# Altium schematic sheet BMS029B_PinConfig.SchDoc: Pin Configuration
size 431 x 279 mm; Date: Not shown in title block; ApprovedBy: Not shown in title block; CheckedBy: Not shown in title block; Author: Not shown in title block; CompanyName: Not shown in title block; DrawnBy: M Sunna; Engineer: Not shown in title block; Organization: Not shown in title block; Address1: Not shown in title block; Address2: Not shown in title block; Address3: Not shown in title block; Address4: Not shown in title block; DocumentNumber: 2; Revision: Use project parameter SCH_Rev; SheetNumber: 2; SheetTotal: 5; PageSetup: Record=PageOptions|CenterHorizontal=True|CenterVertical=True|PrintScale=1.00|XCorrection=1.00|YCorrection=1.00|PrintKind=0|BorderSize=5000000|LeftOffset=0|BottomOffset=0|Orientation=2|PaperLength=1000|PaperWidth=1000|Scale=100|PaperSource=15|PrintQuality=600|MediaType=1|DitherType=10|PaperKind=Letter|PrintScaleMode=1; CurrentTime: Not shown in title block; CurrentDate: Not shown in title block; Time: Not shown in title block; DocumentFullPathAndName: Not shown in title block; DocumentName: Not shown in title block; ModifiedDate: Not shown in title block; ImagePath: Not shown in title block
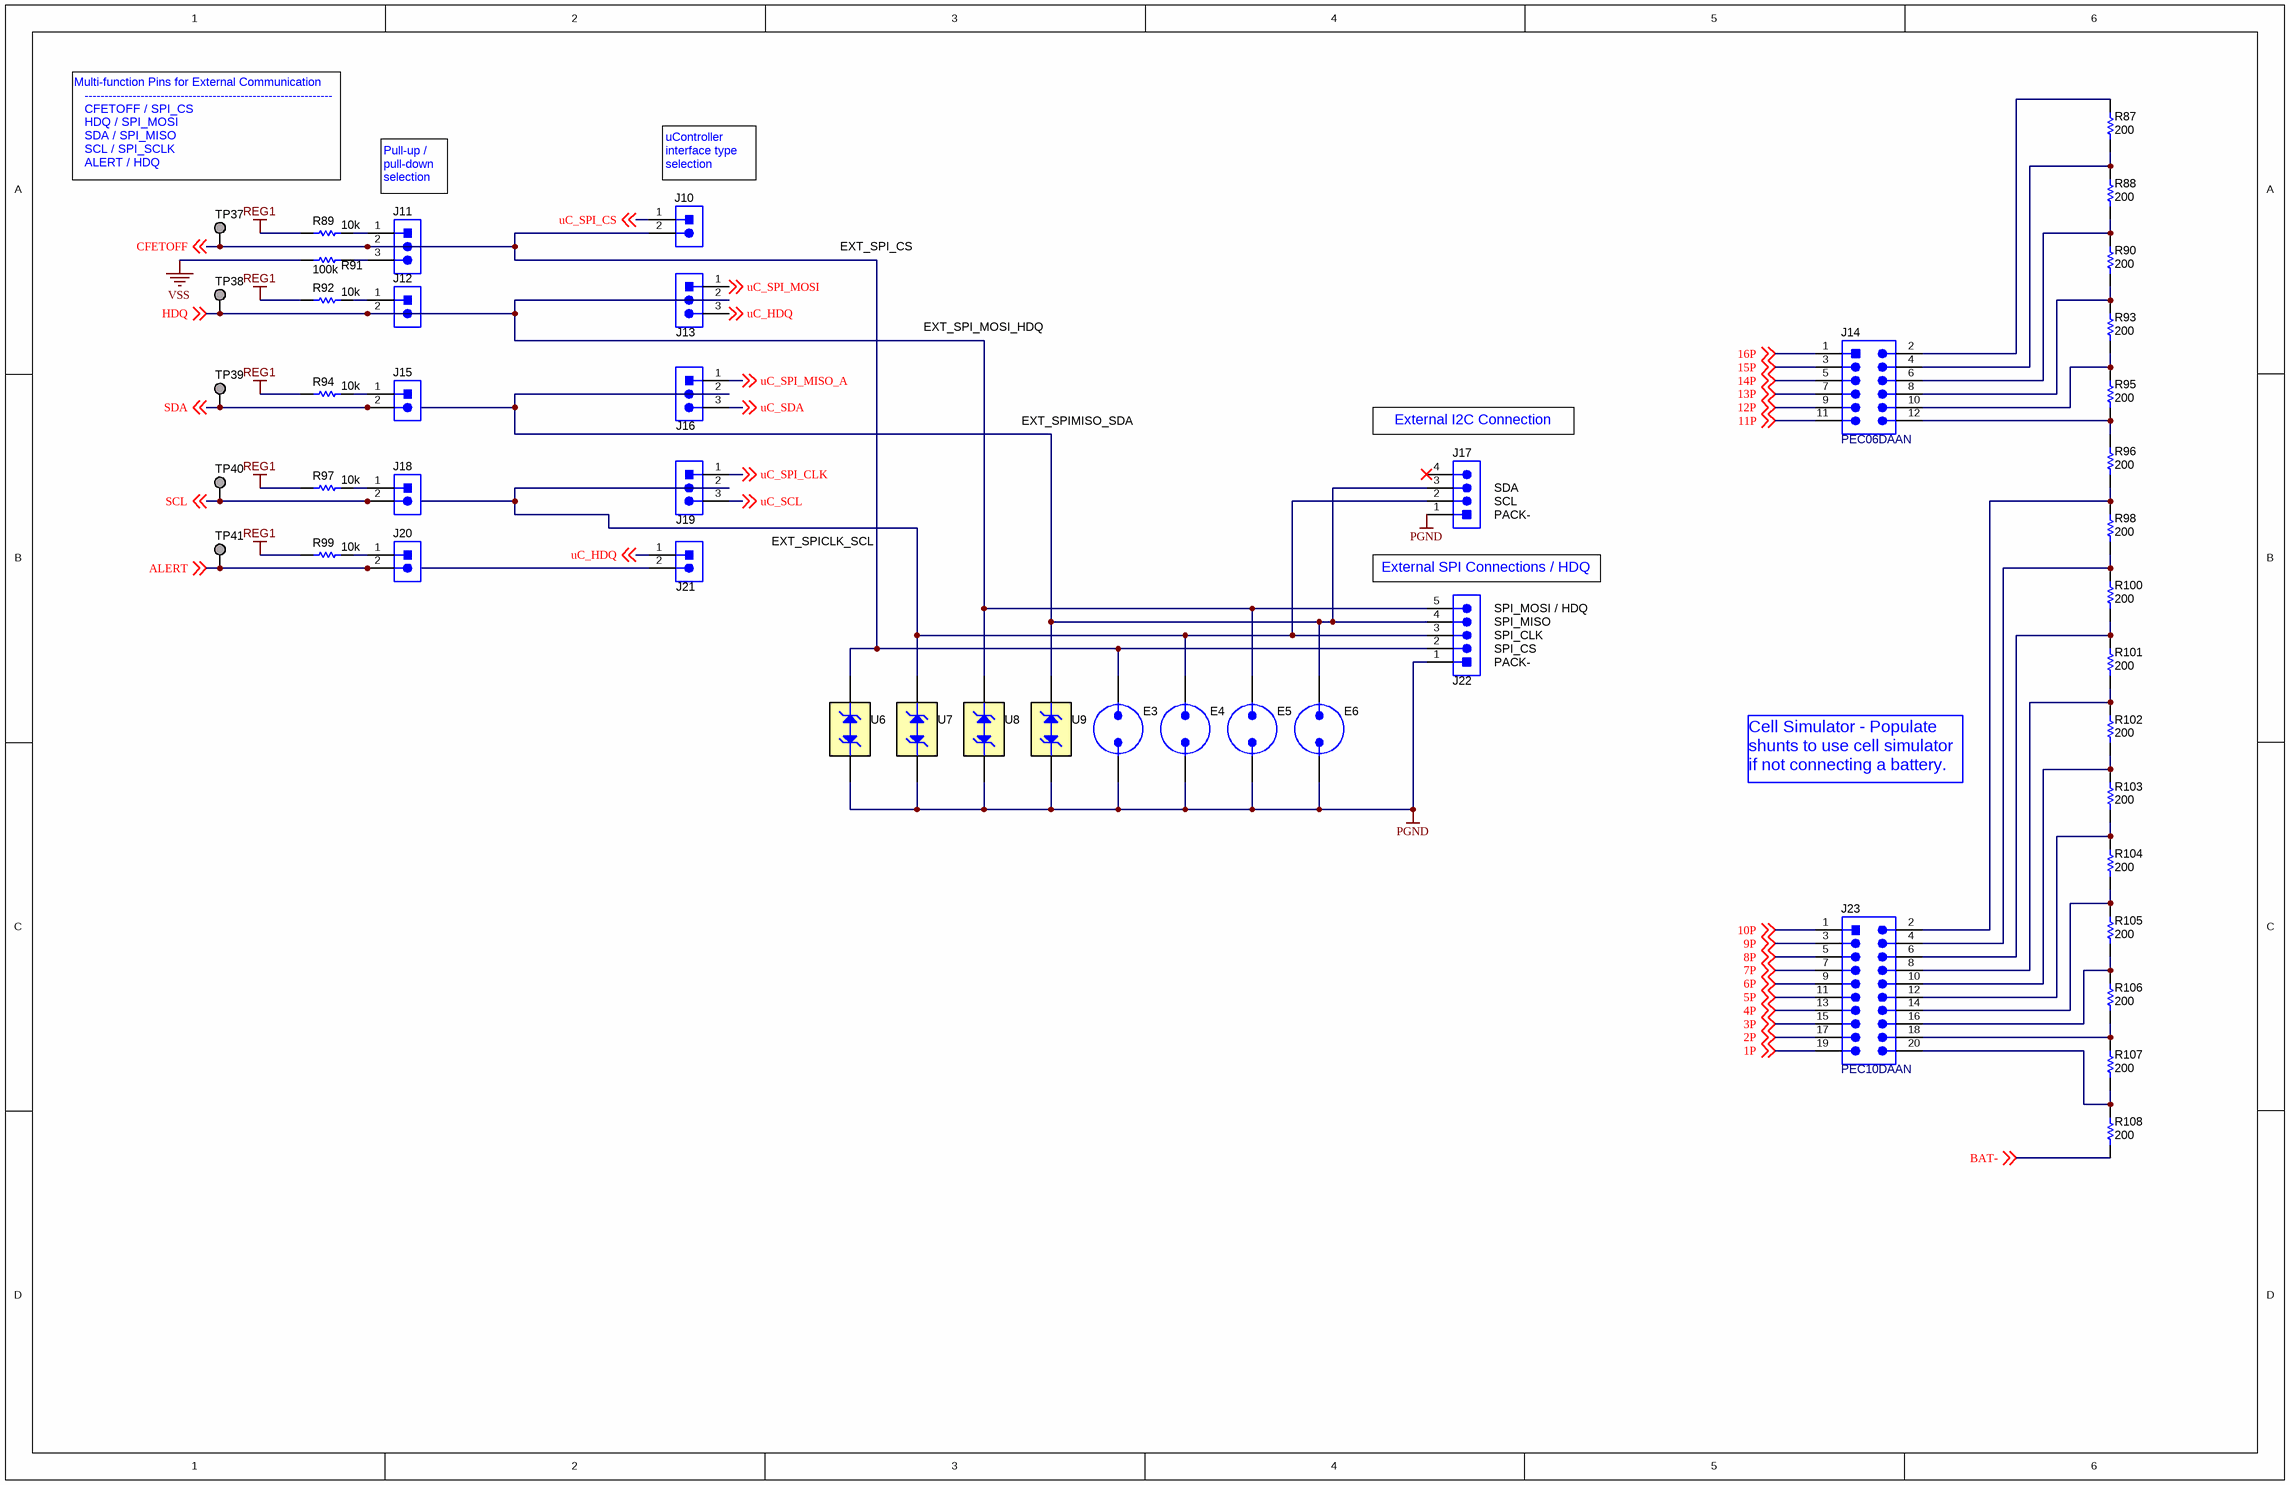
[diagram p0: BMS029B_PinConfig.SchDoc]

## Parts
E3  Spark Gap  [SPARK_GAP2]  (value not drawn)  (no BOM)
E4  Spark Gap  [SPARK_GAP2]  (value not drawn)  (no BOM)
E5  Spark Gap  [SPARK_GAP2]  (value not drawn)  (no BOM)
E6  Spark Gap  [SPARK_GAP2]  (value not drawn)  (no BOM)
J10  PEC02SAAN  [CONN_PEC02SAAN]  (value not drawn)
J11  87898-0304  [Molex_87898-0304]  (value not drawn)
J12  PEC02SAAN  [CONN_PEC02SAAN]  (value not drawn)
J13  87898-0304  [Molex_87898-0304]  (value not drawn)
J14  PEC06DAAN  [CONN_PEC06DAAN]
J15  PEC02SAAN  [CONN_PEC02SAAN]  (value not drawn)
J16  87898-0304  [Molex_87898-0304]  (value not drawn)
J17  22/05/3041  [CONN_22-05-3041]  (value not drawn)
J18  PEC02SAAN  [CONN_PEC02SAAN]  (value not drawn)
J19  87898-0304  [Molex_87898-0304]  (value not drawn)
J20  PEC02SAAN  [CONN_PEC02SAAN]  (value not drawn)
J21  PEC02SAAN  [CONN_PEC02SAAN]  (value not drawn)
J22  PEC05SAAN  [Sullins_PxC05SAAN]  (value not drawn)
J23  PEC10DAAN  [SULLINS_PEC10DAAN]
R87  ValueDisplayed: 200  [1206]  (hidden comment: CRCW1206200RFKEA)
R88  ValueDisplayed: 200  [1206]  (hidden comment: CRCW1206200RFKEA)
R89  ValueDisplayed: 10k  [0603]  (hidden comment: CRCW060310K0JNEA)
R90  ValueDisplayed: 200  [1206]  (hidden comment: CRCW1206200RFKEA)
R91  ValueDisplayed: 100k  [0603]  (hidden comment: CRCW0603100KJNEA)
R92  ValueDisplayed: 10k  [0603]  (hidden comment: CRCW060310K0JNEA)
R93  ValueDisplayed: 200  [1206]  (hidden comment: CRCW1206200RFKEA)
R94  ValueDisplayed: 10k  [0603]  (hidden comment: CRCW060310K0JNEA)
R95  ValueDisplayed: 200  [1206]  (hidden comment: CRCW1206200RFKEA)
R96  ValueDisplayed: 200  [1206]  (hidden comment: CRCW1206200RFKEA)
R97  ValueDisplayed: 10k  [0603]  (hidden comment: CRCW060310K0JNEA)
R98  ValueDisplayed: 200  [1206]  (hidden comment: CRCW1206200RFKEA)
R99  ValueDisplayed: 10k  [0603]  (hidden comment: CRCW060310K0JNEA)
R100  ValueDisplayed: 200  [1206]  (hidden comment: CRCW1206200RFKEA)
R101  ValueDisplayed: 200  [1206]  (hidden comment: CRCW1206200RFKEA)
R102  ValueDisplayed: 200  [1206]  (hidden comment: CRCW1206200RFKEA)
R103  ValueDisplayed: 200  [1206]  (hidden comment: CRCW1206200RFKEA)
R104  ValueDisplayed: 200  [1206]  (hidden comment: CRCW1206200RFKEA)
R105  ValueDisplayed: 200  [1206]  (hidden comment: CRCW1206200RFKEA)
R106  ValueDisplayed: 200  [1206]  (hidden comment: CRCW1206200RFKEA)
R107  ValueDisplayed: 200  [1206]  (hidden comment: CRCW1206200RFKEA)
R108  ValueDisplayed: 200  [1206]  (hidden comment: CRCW1206200RFKEA)
TP37  TESTPOINT  [TP_50MIL-25MILHOLE]  (value not drawn)  (no BOM)
TP38  TESTPOINT  [TP_50MIL-25MILHOLE]  (value not drawn)  (no BOM)
TP39  TESTPOINT  [TP_50MIL-25MILHOLE]  (value not drawn)  (no BOM)
TP40  TESTPOINT  [TP_50MIL-25MILHOLE]  (value not drawn)  (no BOM)
TP41  TESTPOINT  [TP_50MIL-25MILHOLE]  (value not drawn)  (no BOM)
U6  TPD1E10B06DPYR  [DPY0002A]  (value not drawn)
U7  TPD1E10B06DPYR  [DPY0002A]  (value not drawn)
U8  TPD1E10B06DPYR  [DPY0002A]  (value not drawn)
U9  TPD1E10B06DPYR  [DPY0002A]  (value not drawn)

## Nets
PGND: E3.2 E4.2 E5.2 E6.2 J17.1 J22.1 U6.2(A) U7.2(A) U8.2(A) U9.2(A)
REG1: R89.1 R92.1 R94.1 R97.1 R99.1
VSS: R91.1
1P: J23.19 ; off-sheet 1P
2P: J23.17 ; off-sheet 2P
3P: J23.15 ; off-sheet 3P
4P: J23.13 ; off-sheet 4P
5P: J23.11 ; off-sheet 5P
6P: J23.9 ; off-sheet 6P
7P: J23.7 ; off-sheet 7P
8P: J23.5 ; off-sheet 8P
9P: J23.3 ; off-sheet 9P
10P: J23.1 ; off-sheet 10P
11P: J14.11 ; off-sheet 11P
12P: J14.9 ; off-sheet 12P
13P: J14.7 ; off-sheet 13P
14P: J14.5 ; off-sheet 14P
15P: J14.3 ; off-sheet 15P
16P: J14.1 ; off-sheet 16P
ALERT: J20.2 J21.2 TP41.1 ; off-sheet ALERT
BAT-: R108.1 ; off-sheet BAT-
CFETOFF: E3.1 J10.2 J11.2 J22.2 TP37.1 U6.1(K) ; off-sheet CFETOFF
HDQ: E5.1 J12.2 J13.2 J22.5 TP38.1 U8.1(K) ; off-sheet HDQ
SCL: E4.1 J17.2 J18.2 J19.2 J22.3 TP40.1 U7.1(K) ; off-sheet SCL
SDA: E6.1 J15.2 J16.2 J17.3 J22.4 TP39.1 U9.1(K) ; off-sheet SDA
uC_HDQ: J13.3 J21.1 ; off-sheet uC_HDQ
uC_SCL: J19.3 ; off-sheet uC_SCL
uC_SDA: J16.3 ; off-sheet uC_SDA
uC_SPI_CLK: J19.1 ; off-sheet uC_SPI_CLK
uC_SPI_CS: J10.1 ; off-sheet uC_SPI_CS
uC_SPI_MISO_A: J16.1 ; off-sheet uC_SPI_MISO_A
uC_SPI_MOSI: J13.1 ; off-sheet uC_SPI_MOSI
NetJ11_1: J11.1 R89.2
NetJ11_3: J11.3 R91.2
NetJ12_1: J12.1 R92.2
NetJ14_2: J14.2 R87.2
NetJ14_4: J14.4 R87.1 R88.2
NetJ14_6: J14.6 R88.1 R90.2
NetJ14_8: J14.8 R90.1 R93.2
NetJ14_10: J14.10 R93.1 R95.2
NetJ14_12: J14.12 R95.1 R96.2
NetJ15_1: J15.1 R94.2
NetJ18_1: J18.1 R97.2
NetJ20_1: J20.1 R99.2
NetJ23_2: J23.2 R96.1 R98.2
NetJ23_4: J23.4 R98.1 R100.2
NetJ23_6: J23.6 R100.1 R101.2
NetJ23_8: J23.8 R101.1 R102.2
NetJ23_10: J23.10 R102.1 R103.2
NetJ23_12: J23.12 R103.1 R104.2
NetJ23_14: J23.14 R104.1 R105.2
NetJ23_16: J23.16 R105.1 R106.2
NetJ23_18: J23.18 R106.1 R107.2
NetJ23_20: J23.20 R107.1 R108.2

Not connected (* = marked no-connect by the designer): J17 4*

## Notes on the sheet
- Multi-function Pins for External Communication
  --------------------------------------------------------------
  CFETOFF / SPI_CS
  HDQ / SPI_MOSI
  SDA / SPI_MISO
  SCL / SPI_SCLK
  ALERT / HDQ
- Pull-up / pull-down selection
- (near J10) uController interface type selection
- EXT_SPI_CS
- EXT_SPI_MOSI_HDQ
- EXT_SPIMISO_SDA
- (near J17) External I2C Connection
- (near J17) SDA
- (near J17) SCL
- EXT_SPICLK_SCL
- (near J17) PACK-
- External SPI Connections / HDQ
- (near J22) SPI_MISO
- (near J22) SPI_MOSI / HDQ
- (near J22) SPI_CLK
- (near J22) SPI_CS
- (near J22) PACK-
- Cell Simulator - Populate shunts to use cell simulator if not connecting a battery.

## Library data of the parts
E3-E6 = CMP-0079939-1: CompType: Spark Gap
J10 J12 J15 J18 J20 J21 = CMP-0002337-1: Header, 100mil, 2x1, Tin, TH; Manufacturer: Sullins Connector Solutions; CNHeader: TRUE; Current_A: 3A; Green_Lifecycle: Not Set; Shrouded: N; Gender: Male; Green_REACh: Incomplete; Voltage_V: 1.8kV; Row_Count: 1; Pitch_mm: 2.54; CT: FALSE; Cert_UL: Y; ComponentLink1URL: http://www.sullinscorp.com/catalogs/77_PAGE108-109_.100_MALE_HDR.pdf; ClassName: Header; Publisher: Texas Instruments; Color: Black; RoHS: Y; MountType: TH; Green_EU RoHS-2: Incomplete; Supplier 1: Digi-Key; Green_EU RoHS: Incomplete; PackageReference: Header, 2 PIN, 100mil, Tin; PinCount: 2; CompType: Header; LatestRevisionDate: 26/05/2017; PartNumber: PEC02SAAN; Orientation: Vertical; ComponentLink1Description: Datasheet URL; Supplier Part Number 1: S1012E-02-ND; ContactFinish: Tin
J11 J13 J16 J19 = CMP-0075388-1: Header, 2.54mm, 3x1, Gold, SMT; Manufacturer: Molex; Pitch_mm: 2.54; Gender: Male; Cert_CSA: Y; Current_A: 3A; Voltage_V: 250V; CT: False; Shrouded: N; Row_Count: 1; CNHeader: True; ComponentLink1Description: Datasheet URL; RoHS: Y; Supplier Part Number 3: 538-87898-0304; Supplier 1: Digi-Key; Cert_UL: Y; Orientation: Vertical; PackageReference: Header, 2.54mm, 3x1, SMT; Color: Black; PartNumber: 87898-0304; PinCount: 3; Publisher: Texas Instruments; Supplier Part Number 2: 39T3063; ContactFinish: Gold; Supplier 2: Newark; ClassName: Header; ComponentLink1URL: http://www.molex.com/pdm_docs/sd/878980204_sd.pdf; LatestRevisionDate: 2017-07-14; CompType: Header; MountType: SMT; Supplier Part Number 1: 0878980304-ND; Supplier 3: Mouser
J14 = CMP-0054551-2: Header, 100mil, 6x2, Tin, TH; Manufacturer: Sullins Connector Solutions; Current_A: 3A; Green_Lifecycle: Not Set; Shrouded: N; Gender: Male; Green_REACh: Incomplete; Voltage_V: 1.8kV; Row_Count: 2; RowSpacing_mm: 2.54; Cert_UL: Y; ComponentLink1URL: http://www.sullinscorp.com/catalogs/77_PAGE108-109_.100_MALE_HDR.pdf; ClassName: Header; Color: Black; RoHS: Y; MountType: TH; Green_EU RoHS-2: Incomplete; Supplier 1: Digi-Key; Green_EU RoHS: Incomplete; PackageReference: Header, 6x2, 100mil, Tin; PinCount: 12; CompType: Header; PartNumber: PEC06DAAN; Orientation: Vertical; ComponentLink1Description: Datasheet URL; Supplier Part Number 1: S2012E-06-ND; Pitch_mm: 2.54; ContactFinish: Tin
J17 = CMP-0055187-1: Header (friction lock), 100mil, 4x1, R/A, TH; Manufacturer: Molex; Green_Lifecycle: Active; Green_REACh: Passed; CNHeader: FALSE; ComponentLink1URL: http://www.molex.com/pdm_docs/sd/022053041_sd.pdf; PackageReference: 4x1 R/A Header; PartNumber: 22/05/3041; ComponentLink1Description: Datasheet URL; CompType: Header; RoHS: Y; MountType: TH; Publisher: Texas Instruments; LatestRevisionDate: 26/05/2017; Supplier 1: Digi-Key; Supplier Part Number 1: WM4302-ND; Supplier 2: Newark; Supplier Part Number 2: 27C1932; Supplier 3: Mouser; Supplier Part Number 3: 538-22-05-3041; Green_EU RoHS: Passed; Green_EU RoHS-2: Passed; CT: FALSE
J22 = CMP-0054597-1: Header, 2.54mm, 5x1, Tin, TH; Manufacturer: Sullins Connector Solutions; CNHeader: TRUE; Current_A: 3A; Green_Lifecycle: Not Set; Shrouded: N; Gender: Male; Green_REACh: Incomplete; Voltage_V: 1.8kV; Row_Count: 1; Pitch_mm: 2.54; CT: FALSE; Cert_UL: Y; ComponentLink1URL: http://www.sullinscorp.com/catalogs/77_PAGE108-109_.100_MALE_HDR.pdf; ClassName: Header; Publisher: Texas Instruments; Color: Black; RoHS: Y; MountType: TH; Green_EU RoHS-2: Incomplete; Supplier 1: Digi-Key; Green_EU RoHS: Incomplete; PackageReference: Header, 2.54mm, 5x1, TH; PinCount: 5; CompType: Header; LatestRevisionDate: 26/05/2017; PartNumber: PEC05SAAN; Orientation: Vertical; ComponentLink1Description: Datasheet URL; Supplier Part Number 1: S1012E-05-ND; ContactFinish: Tin
J23 = CMP-0054623-2: Header, 2.54mm, 10x2, Tin, TH; Manufacturer: Sullins Connector Solutions; Current_A: 3A; Green_Lifecycle: Not Set; Shrouded: N; Gender: Male; Green_REACh: Incomplete; Row_Count: 2; RowSpacing_mm: 2.54; Cert_UL: Y; ComponentLink1URL: https://drawings-pdf.s3.amazonaws.com/C10419.pdf; ClassName: Header; Color: Black; RoHS: Y; MountType: TH; Green_EU RoHS-2: Incomplete; Supplier 1: Digi-Key; Green_EU RoHS: Incomplete; PackageReference: Header, 10x2, 2.54mm, TH; PinCount: 20; CompType: Header; PartNumber: PEC10DAAN; Orientation: Vertical; ComponentLink1Description: Datasheet URL; Supplier Part Number 1: S2012E-10-ND; Pitch_mm: 2.54; ContactFinish: Tin
R87 R88 R90 R93 R95 R96 R98 R100-R108 = CMP-0016776-3: RES, 200, 1%, 0.25 W, AEC-Q200 Grade 0, 1206; Manufacturer: Vishay-Dale; Power_W: 250mW; TempCo: 100 ppm/C; Value_Code: 200R; Value: 200; EIA_Code: E96; SizeX_mm: 3.2; SizeY_mm: 1.6; SizeZ_mm: 1.35; Value2: 0.25W; SizeArea_mm2: 5.12; AEC Qualified: Y; VDC_V: 200V; AEC Category: Q200; AEC Grade: 0; Supplier Part Number 2: 53K2137; Supplier 2: Newark; Supplier Part Number 3: 71-CRCW1206-200-E3; Supplier 3: Mouser; RoHS: E; Value1: 1%; MountType: SMT; Supplier 1: Digi-Key; PackageReference: 1206; Tolerance_%: 1%; Res_ohm: 200; CompType: Resistor; PartNumber: CRCW1206200RFKEA; ComponentLink1Description: Datasheet link; Supplier Part Number 1: 541-200FCT-ND; Technology: Thick Film; ComponentLink1URL: http://www.vishay.com/docs/20035/dcrcwe3.pdf
R89 R92 R94 R97 R99 = CMP-0025701-4: RES, 10 k, 5%, 0.1 W, AEC-Q200 Grade 0, 0603; Manufacturer: Vishay-Dale; Power_W: 100mW; TempCo: 200 ppm/C; Value_Code: 10k0; Value: 10k; EIA_Code: E24; SizeX_mm: 1.6; SizeY_mm: 0.8; SizeZ_mm: 1; Value2: 0.1W; SizeArea_mm2: 1.28; CompType: Resistor; AEC Qualified: Y; VDC_V: 75V; AEC Category: Q200; AEC Grade: 0; Supplier Part Number 2: 52K8066; Supplier 2: Newark; Supplier Part Number 3: 71-CRCW0603J-10K-E3; Supplier 3: Mouser; RoHS: E; Value1: 5%; MountType: SMT; Supplier 1: Digi-Key; PackageReference: 0603; Tolerance_%: 5%; Res_ohm: 10k; PartNumber: CRCW060310K0JNEA; ComponentLink1Description: Datasheet link; Supplier Part Number 1: 541-10KGCT-ND; Technology: Thick Film; ComponentLink1URL: http://www.vishay.com/docs/20035/dcrcwe3.pdf
R91 = CMP-0025698-4: RES, 100 k, 5%, 0.1 W, AEC-Q200 Grade 0, 0603; Manufacturer: Vishay-Dale; Power_W: 100mW; TempCo: 200 ppm/C; Value: 100k; EIA_Code: E24; SizeX_mm: 1.6; SizeY_mm: 0.8; SizeZ_mm: 1; Value2: 0.1W; SizeArea_mm2: 1.28; AEC Qualified: Y; VDC_V: 75V; AEC Category: Q200; AEC Grade: 0; Supplier Part Number 2: 59M6763; Supplier 2: Newark; Supplier Part Number 3: 71-CRCW0603J-100K-E3; Supplier 3: Mouser; Value_Code: 100k; RoHS: E; Value1: 5%; MountType: SMT; Supplier 1: Digi-Key; PackageReference: 0603; Tolerance_%: 5%; Res_ohm: 100k; CompType: Resistor; PartNumber: CRCW0603100KJNEA; ComponentLink1Description: Datasheet link; Supplier Part Number 1: 541-100KGCT-ND; Technology: Thick Film; ComponentLink1URL: http://www.vishay.com/docs/20035/dcrcwe3.pdf
TP37-TP41 = CMP-0078143-2: TEST POINT.  No entry in BOM.; PartNumber: N/A; CompType: Testpoint; Manufacturer: N/A; PackageReference: N/A; Library Reference: TESTPOINT
U6-U9 = CMP-0043093-3: Single-Channel ESD in 0402 Package With 10pF Capacitance and 6V Breakdown, DPY0002A (X1SON-2); Manufacturer: Texas Instruments; Alternate PartNumber: TPD1E10B06DPYT; IEC 61000-4-2 Air-Gap(+/- kV): 30; Eco-Plan: TBD; IO Capacitance(Typ)(pF): 10; Breakdown Voltage(Min)(V): 6; AEC Category: Q200; AEC Qualified: N; CompType: IC; Green_Lifecycle: Active; Green_REACh: Passed; SizeAreaWB_mm2: 3.2; SizeArea_mm2: 0.6; SizeX_mm: 1.0; SizeZ_mm: 0.45; Rating: Catalog; ComponentLink3Description: Online Datasheet; PackageReference: DPY0002A; PackageDescription: X1SON-2; ComponentLink2URL: http://www.ti.com/product/tpd1e10b06; ComponentLink1URL: http://www.ti.com/lit/ds/symlink/tpd1e10b06.pdf; ComponentLink3URL: http://www.ti.com/product/tpd1e10b06/datasheet; IO Leakage Current(nA): 10; ComponentLink1Description: Datasheet Link; ComponentLink2Description: Product Folder; PartNumber: TPD1E10B06DPYR; IEC 61000-4-2 Contact(+/- kV): 30; Alternate Manufacturer: Texas Instruments; Green_EU RoHS: Passed; Green_EU RoHS-2: Passed; MountType: SMT; RoHS: Y; SizeY_mm: 0.6; Operating Temperature Range: -40 to 125 C